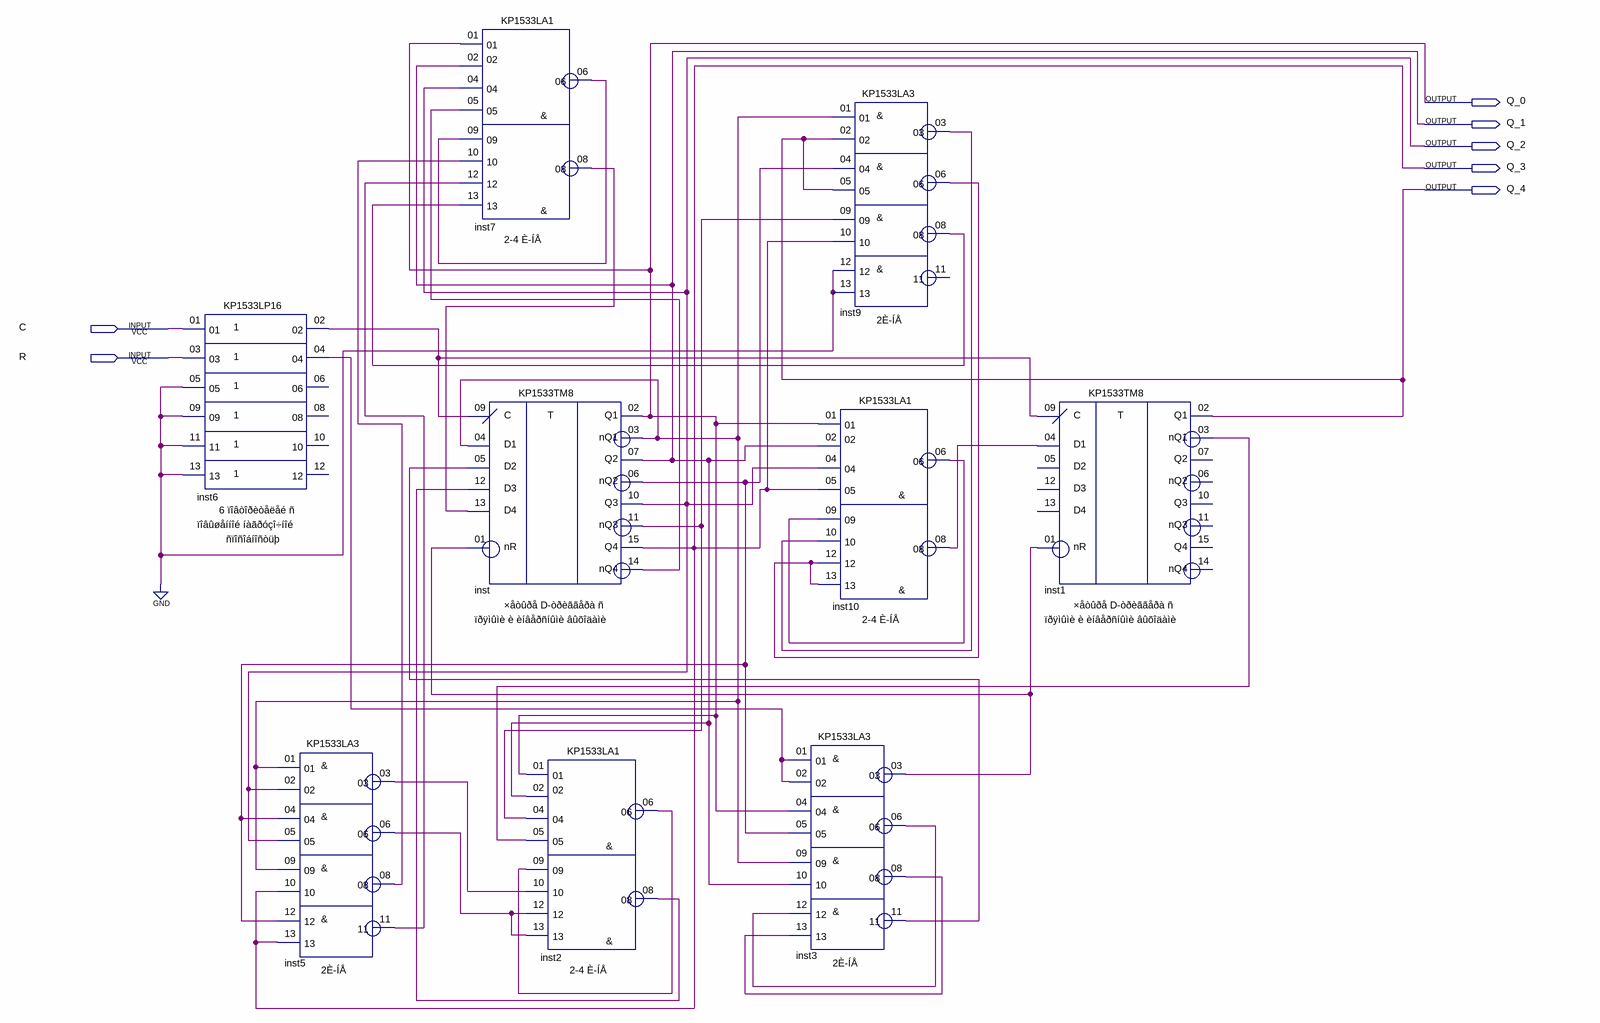
[diagram p0: schematic sheet]
// Quartus schematic Jonson.bdf as structural Verilog: 9 symbols, 7 pins
module Jonson (
  input  C,
  input  R,
  output Q_0,
  output Q_1,
  output Q_2,
  output Q_3,
  output Q_4
);

  wire inst1_nq1, inst2_06, inst2_08, inst3_03, inst3_06, inst3_08, inst3_11, inst5_03, inst5_06, inst5_08,
       inst5_11, inst6_02, inst6_04, inst7_06, inst7_08, inst9_03, inst9_06, inst9_08, inst10_06, inst10_08,
       inst_nq1, inst_nq2, inst_nq3, inst_nq4;

  KP1533LP16 inst6 (
    .\01 (C), .\03 (R), .\05 (1'b0), .\09 (1'b0), .\11 (1'b0), .\13 (1'b0), .\02 (inst6_02), .\04 (inst6_04));  // open: 06, 08, 10, 12
  KP1533LA3 inst5 (
    .\01 (inst_nq1), .\02 (Q_2), .\04 (inst_nq2), .\05 (Q_2), .\09 (inst_nq1), .\10 (Q_3), .\12 (inst_nq2),
    .\13 (Q_3), .\03 (inst5_03), .\06 (inst5_06), .\08 (inst5_08), .\11 (inst5_11));
  KP1533LA1 inst7 (
    .\01 (Q_0), .\02 (Q_1), .\04 (Q_2), .\05 (inst_nq4), .\09 (inst7_06), .\10 (inst5_08), .\12 (inst5_11),
    .\13 (inst9_08), .\06 (inst7_06), .\08 (inst7_08));
  KP1533TM8 inst (
    .nR(inst3_03), .C(inst6_02), .D1(inst_nq1), .D2(inst3_11), .D3(inst2_08), .D4(inst7_08), .Q1(Q_0),
    .nQ1(inst_nq1), .Q2(Q_1), .nQ2(inst_nq2), .Q3(Q_2), .nQ3(inst_nq3), .Q4(Q_3), .nQ4(inst_nq4));
  KP1533LA1 inst2 (
    .\01 (Q_0), .\02 (Q_1), .\04 (inst_nq3), .\05 (inst1_nq1), .\09 (inst2_06), .\10 (inst5_03),
    .\12 (inst5_06), .\13 (inst5_06), .\06 (inst2_06), .\08 (inst2_08));
  KP1533LA3 inst3 (
    .\01 (inst6_04), .\02 (inst6_04), .\04 (Q_0), .\05 (inst_nq2), .\09 (inst_nq1), .\10 (Q_1),
    .\12 (inst3_06), .\13 (inst3_08), .\03 (inst3_03), .\06 (inst3_06), .\08 (inst3_08), .\11 (inst3_11));
  KP1533LA3 inst9 (
    .\01 (inst_nq1), .\02 (Q_4), .\04 (inst_nq2), .\05 (Q_4), .\09 (inst_nq3), .\10 (Q_3), .\12 (1'b0),
    .\13 (1'b0), .\03 (inst9_03), .\06 (inst9_06), .\08 (inst9_08));  // open: 11
  KP1533LA1 inst10 (
    .\01 (Q_0), .\02 (Q_1), .\04 (Q_2), .\05 (Q_3), .\09 (inst10_06), .\10 (inst9_03), .\12 (inst9_06),
    .\13 (inst9_06), .\06 (inst10_06), .\08 (inst10_08));
  KP1533TM8 inst1 (
    .nR(inst3_03), .C(inst6_02), .D1(inst10_08), .Q1(Q_4), .nQ1(inst1_nq1));  // open: D2, D3, D4, Q2, nQ2, Q3, nQ3, Q4, nQ4
endmodule
